# Altium project W-F-DX-C1_Display_PCB-RBM-Asus-ROG.PrjPCB
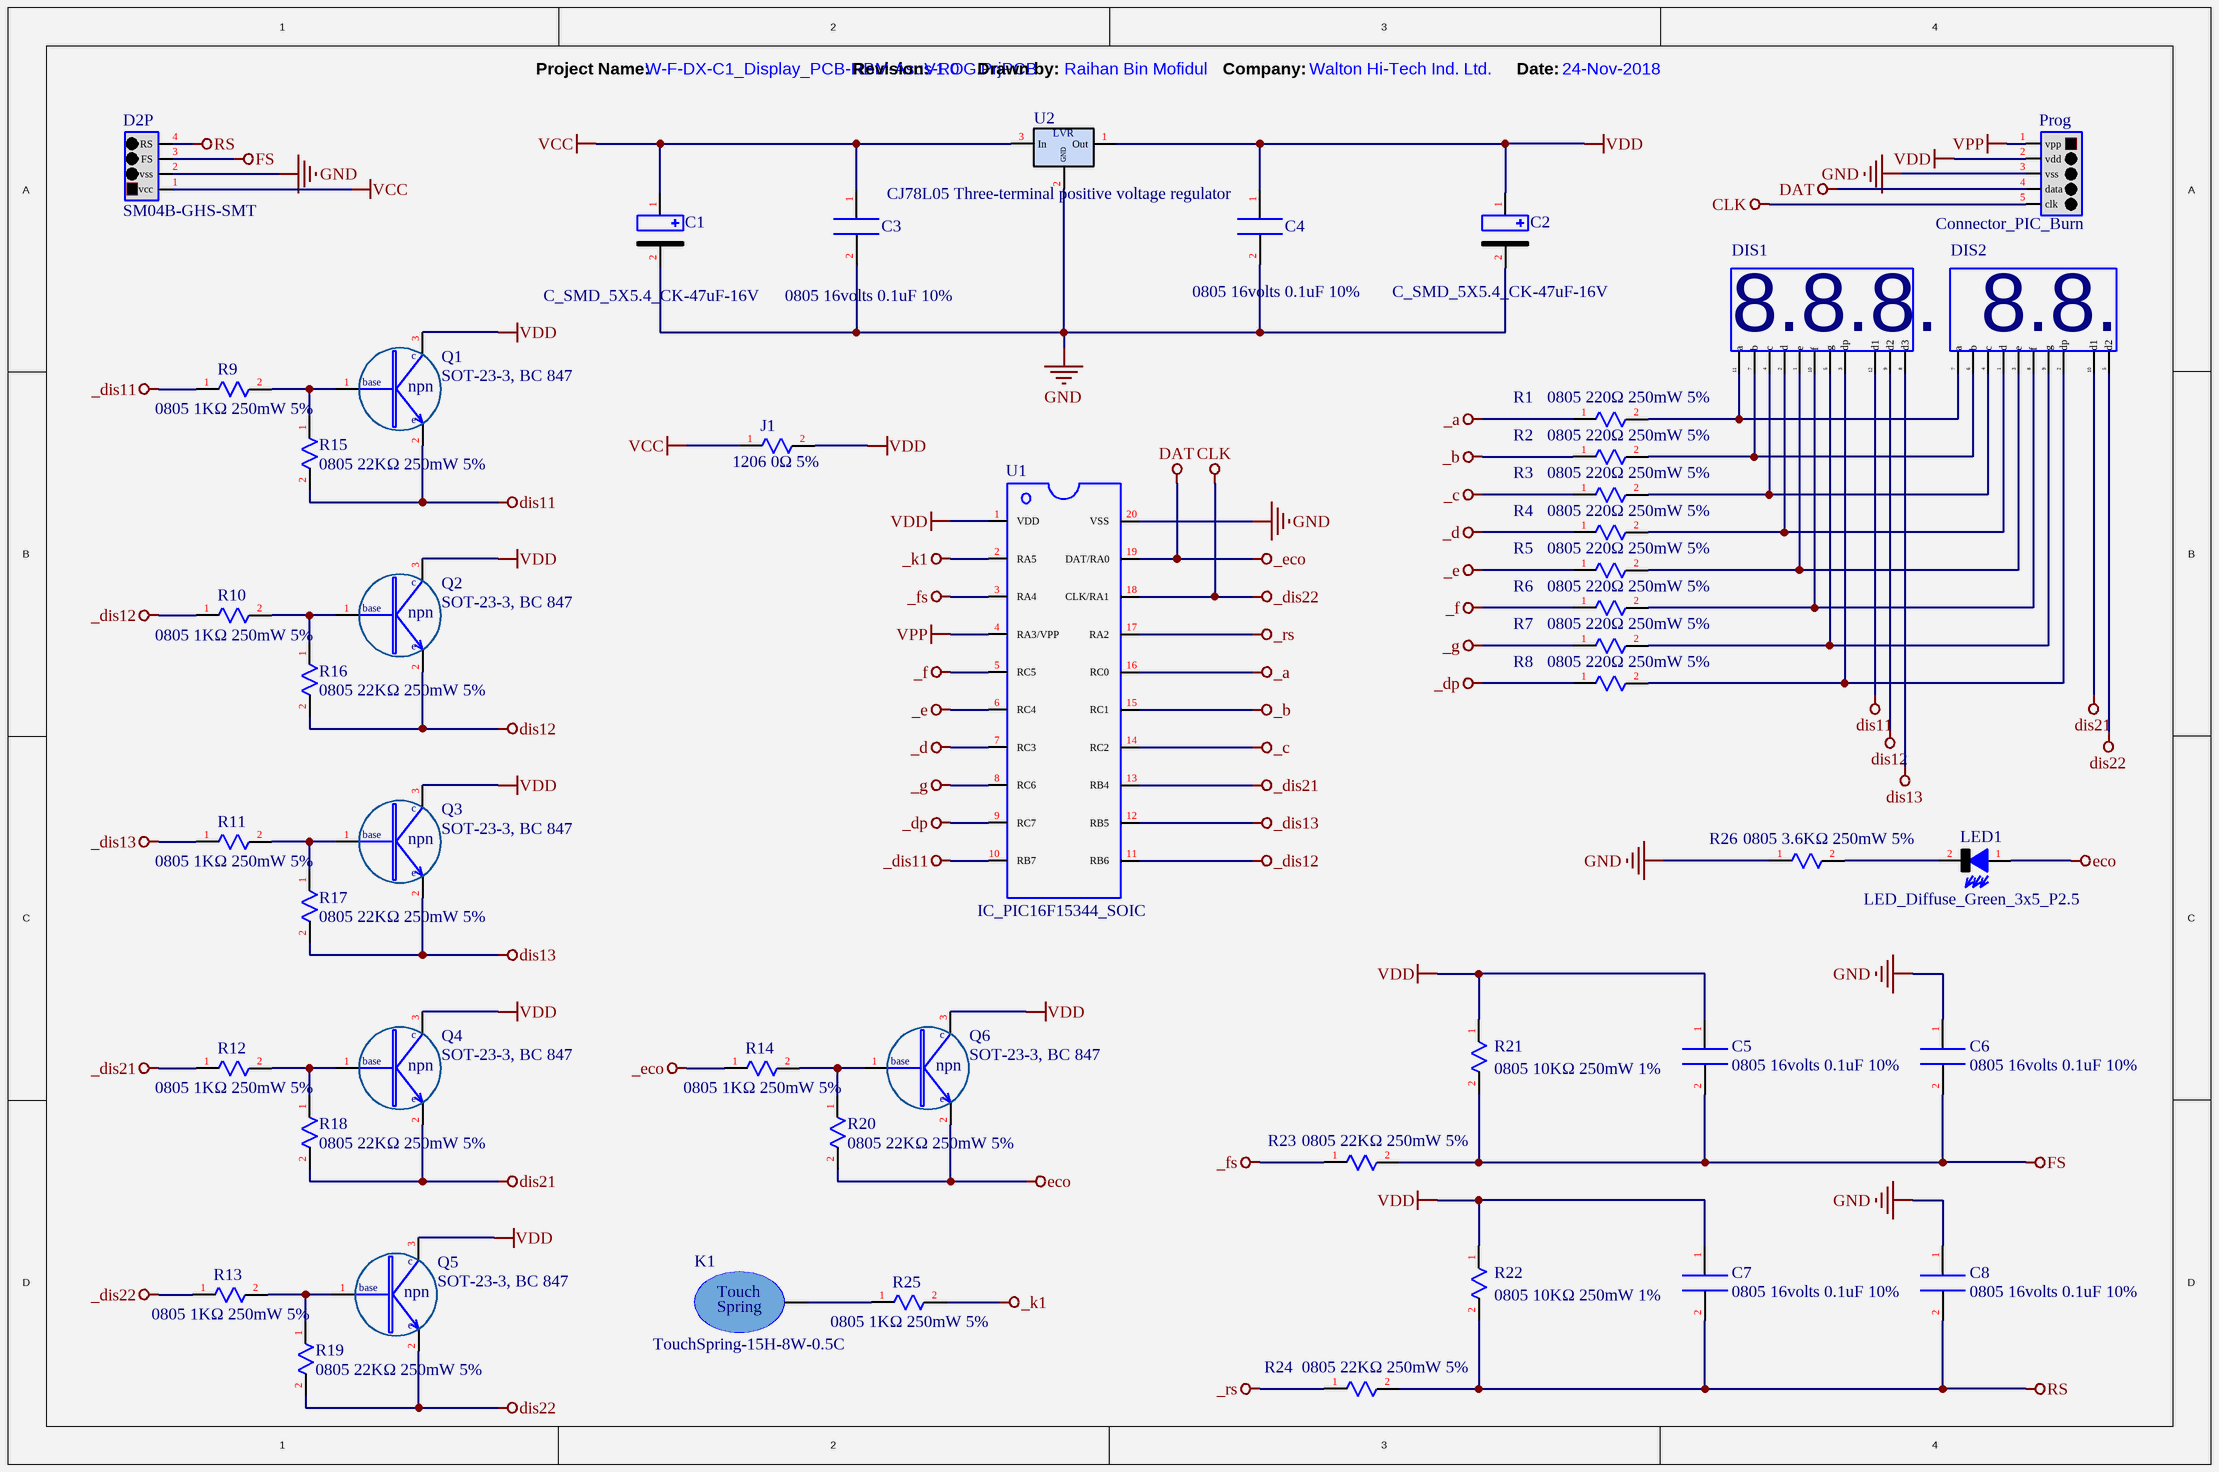
[diagram p0: W-F-DX-C1_Display_PCB.SchDoc]
1 sheet, 49 parts. Net scope: global (net labels, ports and power ports of the same name join across sheets).
Board files: W-F-DX-C1_Display_PCB_wihout3D.PcbDoc, W-F-DX-C1_Display_Panel.PcbDoc

## Sheet W-F-DX-C1_Display_PCB.SchDoc: DK-PM-FV-VC-Buck_NonIsolated
size A4; Date: 24-Nov-2018; CompanyName: Walton Hi-Tech Ind. Ltd.; DrawnBy: Raihan Bin Mofidul; Revision: V1.0

### Parts
C1  C_SMD_5X5.4_CK-47uF-16V  [C_SMD_5X5.4_CK-47uF-16V]
C2  C_SMD_5X5.4_CK-47uF-16V  [C_SMD_5X5.4_CK-47uF-16V]
C3  0805 16volts 0.1uF 10%  [C_0805]
C4  0805 16volts 0.1uF 10%  [C_0805]
C5  0805 16volts 0.1uF 10%  [C_0805]
C6  0805 16volts 0.1uF 10%  [C_0805]
C7  0805 16volts 0.1uF 10%  [C_0805]
C8  0805 16volts 0.1uF 10%  [C_0805]
D2P  SM04B-GHS-SMT  [CN_4P_A2001WR-S-XP-LCP]
DIS1  Display_3Digits Seven Segment  [DIS_56" 3 digit Display]  (value not drawn)
DIS2  Display_2Digits Seven Segment  [Dis_56" 2 digit Display]  (value not drawn)
J1  1206 0Ω 5%  [R_1206]
K1  TouchSpring-15H-8W-0.5C  [T_TouchSpring-15H-8W-0.5C]
LED1  LED_Diffuse_Green_3x5_P2.5  [LED_3x5_P2.5]
Prog  Connector_PIC_Burn  [CN_PIC_MCU_Debugger]
Q1  SOT-23-3, BC 847  [Q_SOT-23-3_NPN_BC847]
Q2  SOT-23-3, BC 847  [Q_SOT-23-3_NPN_BC847]
Q3  SOT-23-3, BC 847  [Q_SOT-23-3_NPN_BC847]
Q4  SOT-23-3, BC 847  [Q_SOT-23-3_NPN_BC847]
Q5  SOT-23-3, BC 847  [Q_SOT-23-3_NPN_BC847]
Q6  SOT-23-3, BC 847  [Q_SOT-23-3_NPN_BC847]
R1  0805 220Ω 250mW 5%  [R_0805]
R2  0805 220Ω 250mW 5%  [R_0805]
R3  0805 220Ω 250mW 5%  [R_0805]
R4  0805 220Ω 250mW 5%  [R_0805]
R5  0805 220Ω 250mW 5%  [R_0805]
R6  0805 220Ω 250mW 5%  [R_0805]
R7  0805 220Ω 250mW 5%  [R_0805]
R8  0805 220Ω 250mW 5%  [R_0805]
R9  0805 1KΩ 250mW 5%  [R_0805]
R10  0805 1KΩ 250mW 5%  [R_0805]
R11  0805 1KΩ 250mW 5%  [R_0805]
R12  0805 1KΩ 250mW 5%  [R_0805]
R13  0805 1KΩ 250mW 5%  [R_0805]
R14  0805 1KΩ 250mW 5%  [R_0805]
R15  0805 22KΩ 250mW 5%  [R_0805]
R16  0805 22KΩ 250mW 5%  [R_0805]
R17  0805 22KΩ 250mW 5%  [R_0805]
R18  0805 22KΩ 250mW 5%  [R_0805]
R19  0805 22KΩ 250mW 5%  [R_0805]
R20  0805 22KΩ 250mW 5%  [R_0805]
R21  0805 10KΩ 250mW 1%  [R_0805]
R22  0805 10KΩ 250mW 1%  [R_0805]
R23  0805 22KΩ 250mW 5%  [R_0805]
R24  0805 22KΩ 250mW 5%  [R_0805]
R25  0805 1KΩ 250mW 5%  [R_0805]
R26  0805 3.6KΩ 250mW 5%  [R_0805]
U1  IC_PIC16F15344_SOIC  [U_PIC16F1XXXX_20pin_SOIC]
U2  CJ78L05 Three-terminal positive voltage regulator  [U_CJ78L05_SOT89]

### Nets
_a: R1.1 U1.16(RC0)
_b: R2.1 U1.15(RC1)
_c: R3.1 U1.14(RC2)
_d: R4.1 U1.7(RC3)
_dis11: R9.1 U1.10(RB7)
_dis12: R10.1 U1.11(RB6)
_dis13: R11.1 U1.12(RB5)
_dis21: R12.1 U1.13(RB4)
_dis22: Prog.5(clk) R13.1 U1.18(CLK/RA1)  [also labelled CLK]
_dp: R8.1 U1.9(RC7)
_e: R5.1 U1.6(RC4)
_eco: Prog.4(data) R14.1 U1.19(DAT/RA0)  [also labelled DAT]
_f: R6.1 U1.5(RC5)
_fs: R23.1 U1.3(RA4)
_g: R7.1 U1.8(RC6)
_k1: R25.2 U1.2(RA5)
_rs: R24.1 U1.17(RA2)
dis11: DIS1.12(d1) Q1.2(Emitter) R15.2
dis12: DIS1.9(d2) Q2.2(Emitter) R16.2
dis13: DIS1.8(d3) Q3.2(Emitter) R17.2
dis21: DIS2.10(d1) Q4.2(Emitter) R18.2
dis22: DIS2.5(d2) Q5.2(Emitter) R19.2
eco: LED1.1(vdd) Q6.2(Emitter) R20.2
FS: C5.2 C6.2 D2P.3(FS) R21.2 R23.2
GND: C1.2(vss) C2.2(vss) C3.2 C4.2 C6.1 C8.1 D2P.2(vss) Prog.3(vss) R26.1 U1.20(VSS) U2.2(GND)
RS: C7.2 C8.2 D2P.4(RS) R22.2 R24.2
VCC: C1.1(vdd) C3.1 D2P.1(vcc) J1.1 U2.3(In)
VDD: C2.1(vdd) C4.1 C5.1 C7.1 J1.2 Prog.2(vdd) Q1.3(Collector) Q2.3(Collector) Q3.3(Collector) Q4.3(Collector) Q5.3(Collector) Q6.3(Collector) R21.1 R22.1 U1.1(VDD) U2.1(Out)
VPP: Prog.1(vpp) U1.4(RA3/VPP)
NetDIS1_1: DIS1.1(e) DIS2.3(e) R5.2
NetDIS1_2: DIS1.2(d) DIS2.1(d) R4.2
NetDIS1_3: DIS1.3(dp) DIS2.2(dp) R8.2
NetDIS1_4: DIS1.4(c) DIS2.4(c) R3.2
NetDIS1_5: DIS1.5(g) DIS2.9(g) R7.2
NetDIS1_7: DIS1.7(b) DIS2.6(b) R2.2
NetDIS1_10: DIS1.10(f) DIS2.8(f) R6.2
NetDIS1_11: DIS1.11(a) DIS2.7(a) R1.2
NetK1_1: K1.1 R25.1
NetLED1_2: LED1.2(vss) R26.2
NetQ1_1: Q1.1(Base) R9.2 R15.1
NetQ2_1: Q2.1(Base) R10.2 R16.1
NetQ3_1: Q3.1(Base) R11.2 R17.1
NetQ4_1: Q4.1(Base) R12.2 R18.1
NetQ5_1: Q5.1(Base) R13.2 R19.1
NetQ6_1: Q6.1(Base) R14.2 R20.1

### Notes on the sheet
- Project Name:
- Revision:
- (near U2) Drawn by:
- Company:
- Date:
- (in symbol BJT_npn) c; base; npn; e
- (in symbol Display_2Digits Seven Segment) 8.8.
- (in symbol Display_3Digits Seven Segment) 8.8.8.
- (in symbol Touch_Spring) Touch; Spring
- (in symbol Voltage Regulator_CJ78L05) LVR

### Library data of the parts
C1 C2 = Capacitor Polar
C3-C8 = Capacitor Non-Polar
D2P = Connector_4PINs: pin to pad: 1>4 2>3 3>2 4>1
DIS1 = Display_3Digits Seven Segment: 3 Digit Seven Segment Display CA
DIS2 = Display_2Digits Seven Segment: 2 Digit Seven Segment Display CA
J1 R1-R26 = Resistor
K1 = Touch_Spring
LED1 = LED
Q1-Q6 = BJT_npn
U1 = IC_PIC16F1XXXX_20PIN
U2 = Voltage Regulator_CJ78L05